# EAGLE design Motherboard (EAGLE 4.16)
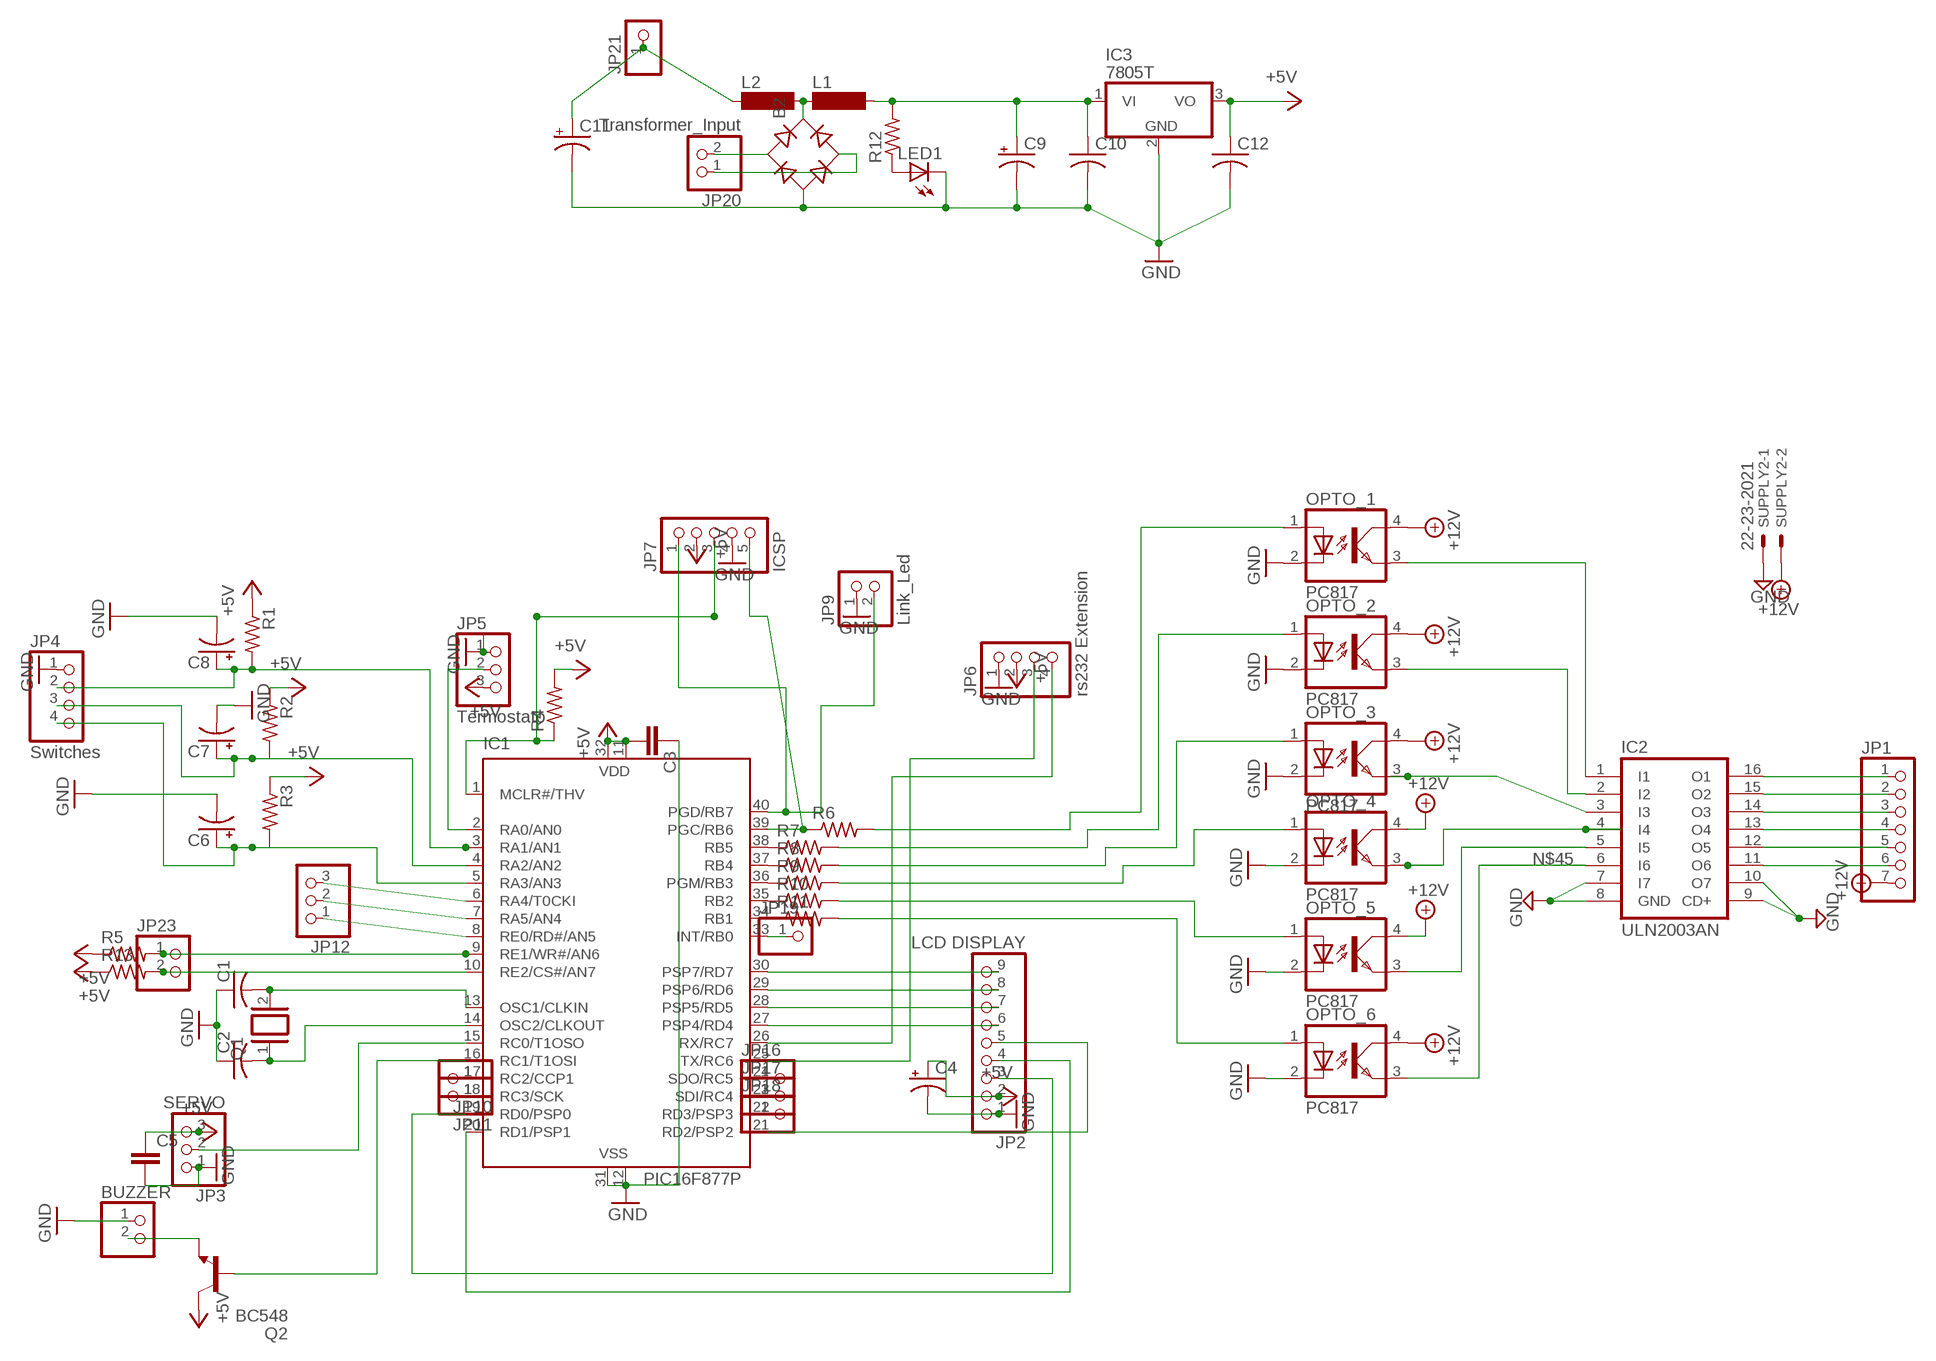
[diagram p0: schematic, sheet 1]

## Parts
B2  RB1A  [RB1A]
BUZZER  PINHD-1X2  [1X02]
C1  C-US050-024X044  [C050-024X044]
C2  C-US050-024X044  [C050-024X044]
C3  C5/2.5  [C5B2.5]
C4  CPOL-USE5-5  [E5-5]
C5  C5/5.5  [C5B5.5]
C6  CPOL-USE2.5-5  [E2,5-5]
C7  CPOL-USE2.5-5  [E2,5-5]
C8  CPOL-USE2.5-5  [E2,5-5]
C9  CPOL-USE5-13  [E5-13]
C10  C-US050-025X075  [C050-025X075]
C11  CPOL-USE5-8.5  [E5-8,5]
C12  C-US050-025X075  [C050-025X075]
IC1  PIC16F877P  [DIL40]
IC2  ULN2003AN  [DIL16]
IC3  7805T  [TO220H]
JP1  PINHD-1X7  [1X07]
JP2  LCD DISPLAY  PINHD-1X9  [1X09]
JP3  SERVO  PINHD-1X3  [1X03]
JP4  Switches  PINHD-1X4  [1X04]
JP5  Termostato  PINHD-1X3  [1X03]
JP6  rs232 Extension  PINHD-1X4  [1X04]
JP7  ICSP  PINHD-1X5  [1X05]
JP9  Link_Led  PINHD-1X2  [1X02]
JP10  PINHD-1X1  [1X01]
JP11  PINHD-1X1  [1X01]
JP12  PINHD-1X3  [1X03]
JP16  PINHD-1X1  [1X01]
JP17  PINHD-1X1  [1X01]
JP18  PINHD-1X1  [1X01]
JP19  PINHD-1X1  [1X01]
JP20  Transformer_Input  PINHD-1X2  [1X02]
JP21  PINHD-1X1  [1X01]
JP23  PINHD-1X2  [1X02]
L1  SD8  [SD8]
L2  SD8  [SD8]
LED1  LED3MM  [LED3MM]
OPTO_1  PC817  [DIL04]
OPTO_2  PC817  [DIL04]
OPTO_3  PC817  [DIL04]
OPTO_4  PC817  [DIL04]
OPTO_5  PC817  [DIL04]
OPTO_6  PC817  [DIL04]
Q1  XTAL  [Q]
Q2  BC548  [TO92-EBC]
R1  R-US_0207/7  [0207/7]
R2  R-US_0207/7  [0207/7]
R3  R-US_0207/7  [0207/7]
R4  R-US_0204/7  [0204/7]
R5  R-US_0204/7  [0204/7]
R6  R-US_0204/7  [0204/7]
R7  R-US_0204/7  [0204/7]
R8  R-US_0204/7  [0204/7]
R9  R-US_0204/7  [0204/7]
R10  R-US_0204/7  [0204/7]
R11  R-US_0204/7  [0204/7]
R12  R-US_0204/7  [0204/7]
R13  R-US_0204/7  [0204/7]
SUPPLY2  22-23-2021  [22-23-2021]

## Nets
+5V: C3.2 C4.+ C5.1 C12.1 IC1.11(VDD) IC1.32(VDD) IC3.3(VO) JP2.2 JP3.3 JP5.3 JP6.2 JP7.2 Q2.C R1.1 R2.1 R3.1 R4.2 R5.1 R13.1
+12V: JP1.7 OPTO_1.4(COL) OPTO_2.4(COL) OPTO_3.4(COL) OPTO_4.4(COL) OPTO_5.4(COL) OPTO_6.4(COL) SUPPLY2.2
GND: B2.- BUZZER.1 C1.1 C2.1 C3.1 C4.- C5.2 C6.- C7.- C8.- C9.- C10.2 C11.- C12.2 IC1.12(VSS) IC1.31(VSS) IC2.7(I7) IC2.8(GND) IC2.9(CD+) IC2.10(O7) IC3.2(GND) JP2.1 JP3.1 JP4.1 JP5.1 JP6.1 JP7.4 JP9.1 LED1.K(C) OPTO_1.2(C) OPTO_2.2(C) OPTO_3.2(C) OPTO_4.2(C) OPTO_5.2(C) OPTO_6.2(C) SUPPLY2.1
N$1: C1.2 IC1.13(OSC1/CLKIN) Q1.2
N$2: C2.2 IC1.14(OSC2/CLKOUT) Q1.1
N$3: C8.+ IC1.3(RA1/AN1) JP4.2 R1.2
N$4: C6.+ IC1.5(RA3/AN3) JP4.4 R3.2
N$5: LED1.A R12.1
N$6: IC1.39(PGC/RB6) JP7.5 R6.1
N$7: IC1.38(RB5) R7.1
N$8: IC1.37(RB4) R8.1
N$9: IC1.36(PGM/RB3) R9.1
N$10: IC1.35(RB2) R10.1
N$11: IC1.34(RB1) R11.1
N$12: IC1.25(TX/RC6) JP6.3
N$13: IC1.26(RX/RC7) JP6.4
N$14: IC1.19(RD0/PSP0) JP2.3
N$15: IC1.20(RD1/PSP1) JP2.4
N$16: IC1.21(RD2/PSP2) JP2.5
N$17: IC1.27(PSP4/RD4) JP2.6
N$18: IC1.28(PSP5/RD5) JP2.7
N$19: IC1.29(PSP6/RD6) JP2.8
N$20: IC1.30(PSP7/RD7) JP2.9
N$21: IC1.1(MCLR#/THV) JP7.3 R4.1
N$22: IC1.2(RA0/AN0) JP5.2
N$23: IC1.33(INT/RB0) JP19.1
N$24: IC1.15(RC0/T1OSO) JP3.2
N$25: IC1.16(RC1/T1OSI) Q2.B
N$26: IC2.12(O5) JP1.5
N$27: IC1.9(RE1/WR#/AN6) JP23.1 R5.2
N$28: IC2.16(O1) JP1.1
N$30: OPTO_2.1(A) R7.2
N$31: OPTO_3.1(A) R8.2
N$32: OPTO_4.1(A) R9.2
N$33: OPTO_5.1(A) R10.2
N$34: OPTO_6.1(A) R11.2
N$35: IC2.15(O2) JP1.2
N$36: IC2.14(O3) JP1.3
N$37: IC2.13(O4) JP1.4
N$38: IC1.8(RE0/RD#/AN5) JP12.1
N$39: IC2.11(O6) JP1.6
N$40: IC2.1(I1) OPTO_1.3(EMIT)
N$41: IC2.2(I2) OPTO_2.3(EMIT)
N$42: IC2.3(I3) OPTO_3.3(EMIT)
N$43: IC2.4(I4) OPTO_4.3(EMIT)
N$44: IC2.5(I5) OPTO_5.3(EMIT)
N$45: IC2.6(I6) OPTO_6.3(EMIT)
N$46: IC1.7(RA5/AN4) JP12.2
N$47: BUZZER.2 Q2.E
N$48: IC1.17(RC2/CCP1) JP10.1
N$49: IC1.18(RC3/SCK) JP11.1
N$50: IC1.6(RA4/T0CKI) JP12.3
N$53: IC1.10(RE2/CS#/AN7) JP23.2 R13.2
N$54: IC1.24(SDO/RC5) JP16.1
N$55: IC1.23(SDI/RC4) JP17.1
N$56: IC1.22(RD3/PSP3) JP18.1
N$57: IC1.40(PGD/RB7) JP7.1 JP9.2
N$58: B2.AC1 JP20.2
N$59: B2.AC2 JP20.1
N$61: C9.+ C10.1 IC3.1(VI) L1.2 R12.2
N$62: B2.+ L1.1 L2.2
N$63: C7.+ IC1.4(RA2/AN2) JP4.3 R2.2
N$64: C11.+ JP21.1 L2.1
N$69: OPTO_1.1(A) R6.2

## Library data of the parts
B2 = rectifier:RB1A: RECTIFIER 1 A
BUZZER JP9 JP20 JP23 = pinhead:PINHD-1X2: PIN HEADER
C1 C2 C10 C12 = rcl:C-US: CAPACITOR, American symbol
C3 C5 = capacitor-wima:C: CAPACITOR naming: grid - package width
C4 C6-C9 C11 = rcl:CPOL-US: POLARIZED CAPACITOR, American symbol
IC1 = microchip:PIC16F87*: MICROCONTROLLER
IC2 = uln-udn:ULN2003A: DRIVER ARRAY
IC3 = linear:78*: Positive VOLTAGE REGULATOR Source: http://cache.national.com/ds/LM/LM78L05.pdf http://www.fairchildsemi.com/ds/LM/LM7805.pdf
JP1 = pinhead:PINHD-1X7: PIN HEADER
JP2 = pinhead:PINHD-1X9: PIN HEADER
JP3 JP5 JP12 = pinhead:PINHD-1X3: PIN HEADER
JP4 JP6 = pinhead:PINHD-1X4: PIN HEADER
JP7 = pinhead:PINHD-1X5: PIN HEADER
JP10 JP11 JP16-JP19 JP21 = pinhead:PINHD-1X1: PIN HEADER
L1 L2 = inductor-neosid:SD8: INDUCTOR nominal inductance
LED1 = led:LED: LED OSRAM: - CHIPLED LG R971, LG N971, LY N971, LG Q971, LY Q971, LO R971, LY R971 LH N974, LH R974 LS Q976, LO Q976, LY Q976 LO Q996 - Hyper CHIPLED LW Q18S LB Q993, LB Q99A, LB R99A - SideLED LS A670, LO A670, LY A670, LG A670, LP A670 LB A673, LV A673, LT A673, LW A673 LH A674 LY A675 LS A676, LA A676, LO A676, LY A676, LW A676 LS A679, LY A679, LG A679 - Hyper Micro SIDELED® LS Y876, LA Y876, LO Y876, LY Y876 LT Y87S - SmartLED LW L88C, LW L88S LB L89C, LB L89S, LG L890 LS L89K, LO L89K, LY L89K LS L896, LA L896, LO L896, LY L896 - TOPLED LS T670, LO T670, LY T670, LG T670, LP T670 LSG T670, LSP T670, LSY T670, LOP T670, LYG T670 LG T671, LOG T671, LSG T671 LB T673, LV T673, LT T673, LW T673 LH T674 LS T676, LA T676, LO T676, LY T676, LB T676, LH T676, LSB T676, LW T676 LB T67C, LV T67C, LT T67C, LS T67K, LO T67K, LY T67K, LW E67C LS E67B, LA E67B, LO E67B, LY E67B, LB E67C, LV E67C, LT E67C LW T67C LS T679, LY T679, LG T679 LS T770, LO T770, LY T770, LG T770, LP T770 LB T773, LV T773, LT T773, LW T773 LH T774 LS E675, LA E675, LY E675, LS T675 LS T776, LA T776, LO T776, LY T776, LB T776 LHGB T686 LT T68C, LB T68C - Hyper Mini TOPLED® LB M676 - Mini TOPLED Santana® LG M470 LS M47K, LO M47K, LY M47K Source: http://www.osram.convergy.de - LUMILED® LXK2-PW12-R00, LXK2-PW12-S00, LXK2-PW14-U00, LXK2-PW14-V00 LXK2-PM12-R00, LXK2-PM12-S00, LXK2-PM14-U00 LXK2-PE12-Q00, LXK2-PE12-R00, LXK2-PE12-S00, LXK2-PE14-T00, LXK2-PE14-U00 LXK2-PB12-K00, LXK2-PB12-L00, LXK2-PB12-M00, LXK2-PB14-N00, LXK2-PB14-P00, LXK2-PB14-Q00 LXK2-PR12-L00, LXK2-PR12-M00, LXK2-PR14-Q00, LXK2-PR14-R00 LXK2-PD12-Q00, LXK2-PD12-R00, LXK2-PD12-S00 LXK2-PH12-R00, LXK2-PH12-S00 LXK2-PL12-P00, LXK2-PL12-Q00, LXK2-PL12-R00 Source: www.luxeon.com
OPTO_1-OPTO_6 = optocoupler:PC817: SHARP OPTO COUPLER
Q1 = special:XTAL: CRYSTAL
Q2 = transistor-npn:BC548*: NPN Transistor
R1-R13 = rcl:R-US_: RESISTOR, American symbol
SUPPLY2 = con-molex:22-23-2021: .100" (2.54mm) Center Header - 2 Pin

## Board
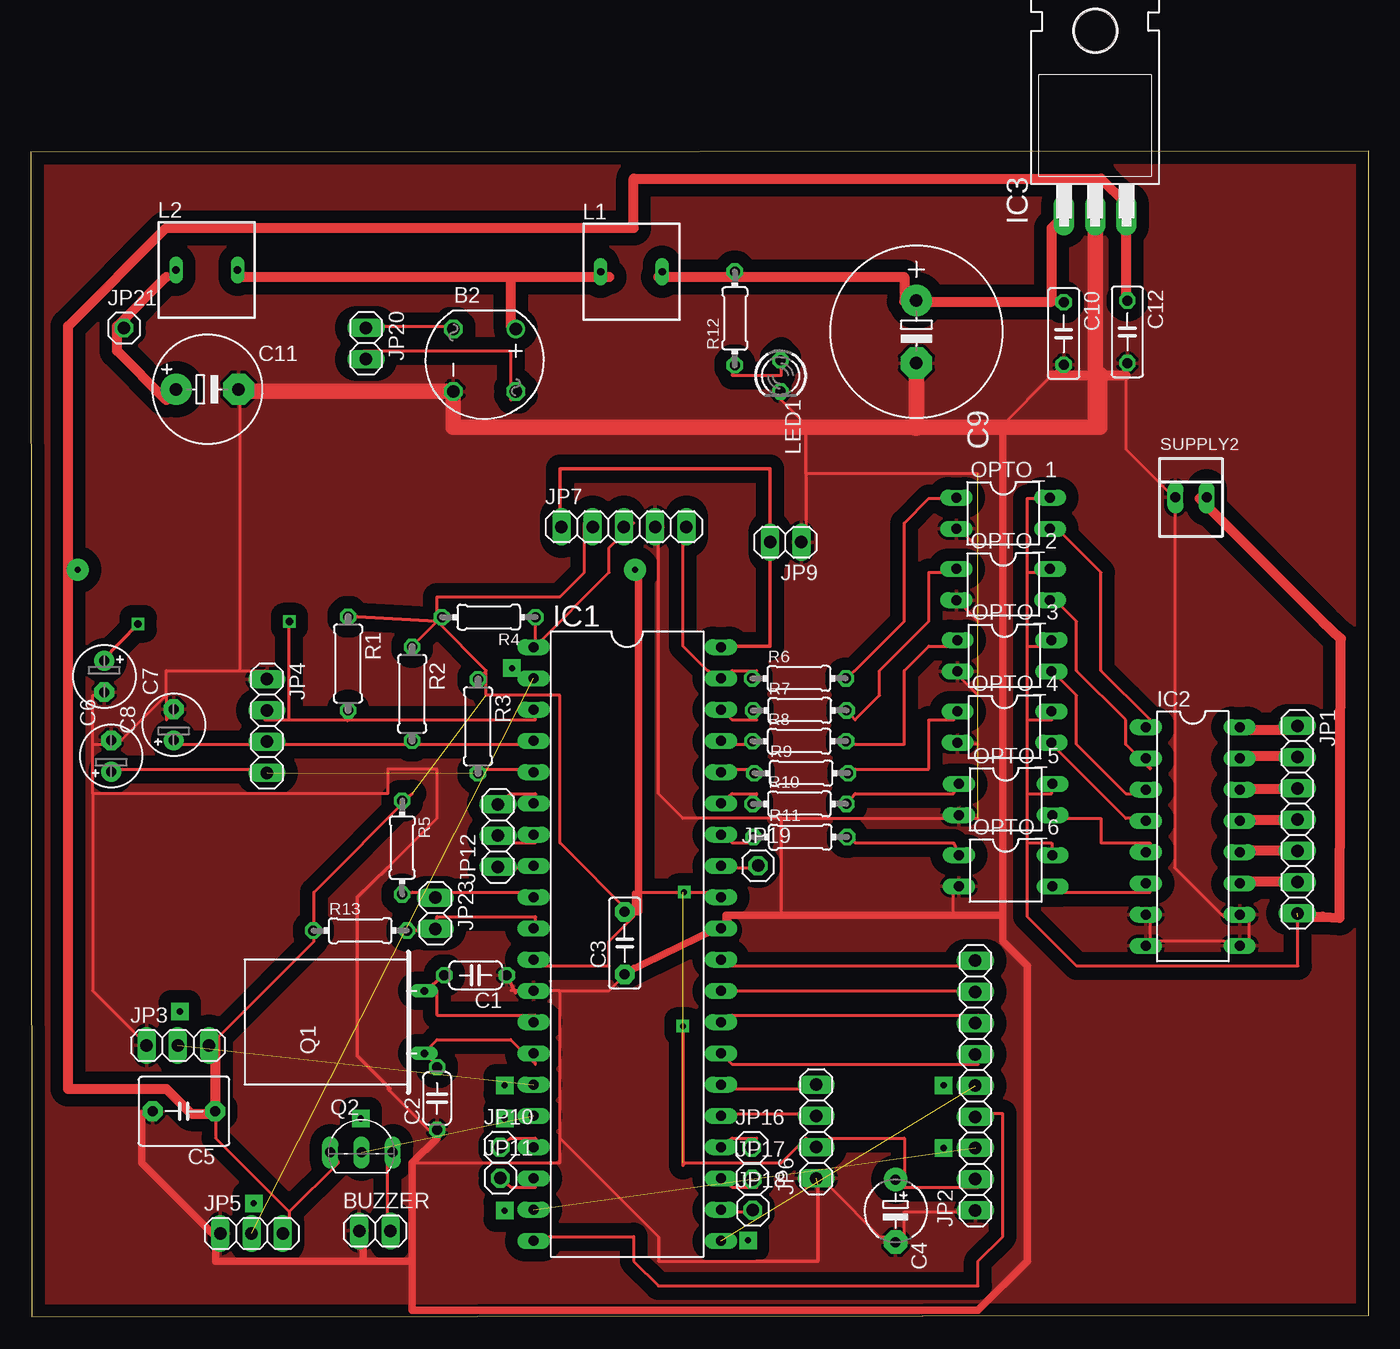
[diagram p1: board, top side]
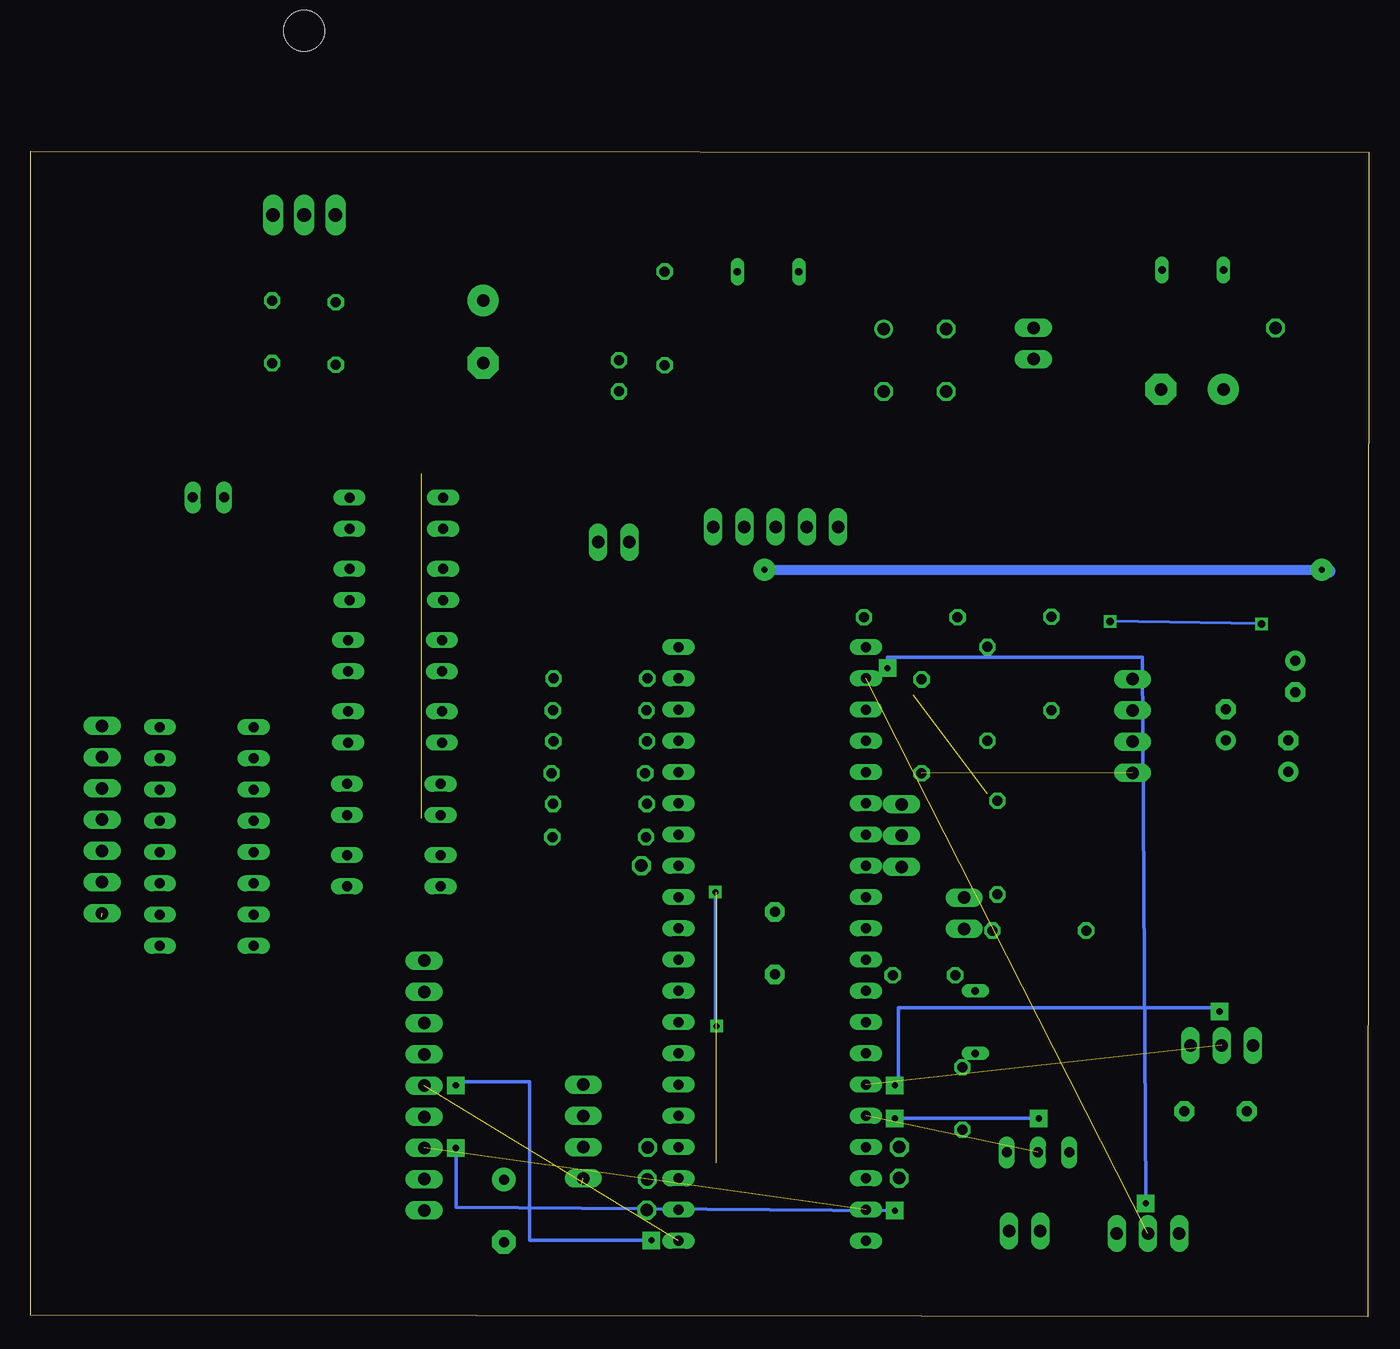
[diagram p2: board, bottom side, seen from below]

Size 108.8 x 94.73 mm. Coordinates in mm from the lower left corner, seen from the top.
Outline: 0.1,0 108.79,0.1 108.8,94.73 0,94.63 0.1,0
Copper layers (1*16): Top 0.035mm / dielectric 1.5mm / Bottom 0.035mm
Design rules "default": minimum track width 10mil, minimum drill 24mil, track to track 8mil, track to pad 8mil, pad to pad 8mil, via to via 8mil, smd to smd 8mil, copper to edge 40mil, drill to drill 8mil, minimum pad ring 10mil, minimum via ring 8mil, stop-mask expansion 4mil, vias tented up to drill 0mil, thermal gap 10mil

### Footprints (pad centres in the part's own frame; a part is rotated, then mirrored left to right if it is on the bottom)
RB1A = drill 1.016 round: + -2.54,2.54 | drill 1.016 octagon: - 2.54,-2.54; AC1 2.54,2.54; AC2 -2.54,-2.54
1X02 = drill 1.016 long: 1 -1.27,0; 2 1.27,0
C050-024X044 = drill 0.813 octagon: 1 -2.54,0; 2 2.54,0
C5B2.5 = drill 0.813 pad 1.6 octagon: 1 -2.54,0; 2 2.54,0
E5-5 = drill 0.813 pad 1.905 round: + -2.54,0 | drill 0.813 pad 1.905 octagon: - 2.54,0
C5B5.5 = drill 0.813 pad 1.6 octagon: 1 -2.54,0; 2 2.54,0
E2,5-5 = drill 0.813 pad 1.6 round: + -1.27,0 | drill 0.813 pad 1.6 octagon: - 1.27,0
E5-13 = drill 1.016 pad 2.54 round: + -2.54,0 | drill 1.016 pad 2.54 octagon: - 2.54,0
C050-025X075 = drill 0.813 octagon: 1 -2.54,0; 2 2.54,0
E5-8,5 = drill 1.016 pad 2.54 round: + -2.54,0 | drill 1.016 pad 2.54 octagon: - 2.54,0
DIL40 = drill 0.813 long: 1 -24.13,-7.62; 2 -21.59,-7.62; 3 -19.05,-7.62; 4 -16.51,-7.62; 5 -13.97,-7.62; 6 -11.43,-7.62; 7 -8.89,-7.62; 8 -6.35,-7.62; 9 -3.81,-7.62; 10 -1.27,-7.62; 11 1.27,-7.62; 12 3.81,-7.62; 13 6.35,-7.62; 14 8.89,-7.62; 15 11.43,-7.62; 16 13.97,-7.62; 17 16.51,-7.62; 18 19.05,-7.62; 19 21.59,-7.62; 20 24.13,-7.62; 21 24.13,7.62; 22 21.59,7.62; 23 19.05,7.62; 24 16.51,7.62; 25 13.97,7.62; 26 11.43,7.62; 27 8.89,7.62; 28 6.35,7.62; 29 3.81,7.62; 30 1.27,7.62; 31 -1.27,7.62; 32 -3.81,7.62; 33 -6.35,7.62; 34 -8.89,7.62; 35 -11.43,7.62; 36 -13.97,7.62; 37 -16.51,7.62; 38 -19.05,7.62; 39 -21.59,7.62; 40 -24.13,7.62
DIL16 = drill 0.813 long: 1 -8.89,-3.81; 2 -6.35,-3.81; 3 -3.81,-3.81; 4 -1.27,-3.81; 5 1.27,-3.81; 6 3.81,-3.81; 7 6.35,-3.81; 8 8.89,-3.81; 9 8.89,3.81; 10 6.35,3.81; 11 3.81,3.81; 12 1.27,3.81; 13 -1.27,3.81; 14 -3.81,3.81; 15 -6.35,3.81; 16 -8.89,3.81
TO220H = drill 1.118 long: 1 -2.54,-10.16; 2 0,-10.16; 3 2.54,-10.16 | hole 3.302: 0,4.826
1X07 = drill 1.016 long: 1 -7.62,0; 2 -5.08,0; 3 -2.54,0; 4 0,0; 5 2.54,0; 6 5.08,0; 7 7.62,0
1X09 = drill 1.016 long: 1 -10.16,0; 2 -7.62,0; 3 -5.08,0; 4 -2.54,0; 5 0,0; 6 2.54,0; 7 5.08,0; 8 7.62,0; 9 10.16,0
1X03 = drill 1.016 long: 1 -2.54,0; 2 0,0; 3 2.54,0
1X04 = drill 1.016 long: 1 -3.81,0; 2 -1.27,0; 3 1.27,0; 4 3.81,0
1X05 = drill 1.016 long: 1 -5.08,0; 2 -2.54,0; 3 0,0; 4 2.54,0; 5 5.08,0
1X01 = drill 1.016 octagon: 1 0,0
SD8 = drill 0.6 long: 1 -2.5,0; 2 2.5,0
LED3MM = drill 0.813 octagon: A -1.27,0; K 1.27,0
DIL04 = drill 0.813 long: 1 -1.27,-3.81; 2 1.27,-3.81; 3 1.27,3.81; 4 -1.27,3.81
Q = drill 0.61 long: 1 -2.54,-7.62; 2 2.54,-7.62
TO92-EBC = drill 0.813 long: B 0,-1.27; C -2.54,-1.27; E 2.54,-1.27
0207/7 = drill 0.813 octagon: 1 -3.81,0; 2 3.81,0
0204/7 = drill 0.813 octagon: 1 -3.81,0; 2 3.81,0
22-23-2021 = drill 0.813 long: 1 -1.27,0; 2 1.27,0

### Placement (x,y rotation side)
B2  36.9,77.73 270 top
BUZZER  27.99,6.96 0 top
C1  36.17,27.74 180 top
C2  33.04,17.73 90 top
C3  48.3,30.35 90 top
C4  70.33,8.59 270 top
C5  12.46,16.69 180 top
C6  6.54,45.56 90 top
C7  11.63,48.1 90 top
C8  5.98,52.03 270 top
C9  72.01,80.04 270 top
C10  83.99,79.9 270 top
C11  14.36,75.37 0 top
C12  89.17,80.04 270 top
IC1  48.5,30.28 270 top
IC2  94.49,39.03 270 top
IC3  86.56,99.69 0 top
JP1  102.99,40.4 270 top
JP2  76.81,18.78 90 top
JP3  11.96,22.04 0 top
JP4  19.21,48 270 top
JP5  17.96,6.76 0 top
JP6  63.87,15.04 90 top
JP7  48.23,64.19 0 top
JP9  61.39,62.94 180 top
JP10  38.17,13.77 0 top
JP11  38.18,11.25 0 top
JP12  38,39.09 90 top
JP16  58.62,13.75 0 top
JP17  58.66,11.15 0 top
JP18  58.7,8.65 0 top
JP19  59.14,36.65 0 top
JP20  27.27,79.1 270 top
JP21  7.58,80.35 0 top
JP23  32.9,32.78 270 top
L1  48.85,84.93 0 top
L2  14.31,85.07 0 top
LED1  60.96,76.47 270 top
OPTO_1  79.08,65.29 270 top
OPTO_2  79.08,59.5 270 top
OPTO_3  79.18,53.71 270 top
OPTO_4  79.18,47.92 270 top
OPTO_5  79.28,42.03 270 top
OPTO_6  79.28,36.24 270 top
Q1  24.37,23.93 90 top
Q2  26.89,14.61 0 top
R1  25.8,53.08 270 top
R2  31.01,50.62 270 top
R3  36.36,47.98 270 top
R4  37.24,56.85 180 top
R5  30.2,38.12 270 top
R6  62.47,51.87 0 top
R7  62.53,49.27 0 top
R8  62.49,46.77 0 top
R9  62.65,44.17 0 top
R10  62.51,41.67 0 top
R11  62.57,38.97 0 top
R12  57.25,81.13 90 top
R13  26.79,31.37 0 top
SUPPLY2  94.35,66.58 0 top

### Tracks (layer width: path | path; a pad name or v marks a point on that pad's centre or on a via)
+5V  (via drill 0.5 pad 1.02)  (2 unrouted)
  Top 0.254: 71.03,10.5 77.03,10.5 JP2.2 | 71.03,10.5 71.03,14.5 65.03,14.5 JP6.2 63.03,14.5 61.03,12.5 53.03,12.5 | 71.03,10.5 C4.+ | 49.03,32.5 47.03,30.5 47.03,28.5 41.03,28.5 IC1.11 | 49.03,32.5 49.03,34.5 53.03,34.5 v53.13,34.5 55.03,34.5 IC1.32 | 21.03,8.5 25.03,12.5 Q2.C | 21.03,8.5 21.03,6.5 JP5.3 | 23.03,30.5 15.03,22.5 JP3.3 | 23.03,30.5 23.03,34.5 31.03,42.5 R5.1 | 23.03,30.5 R13.1 | 21.03,8.5 15.03,14.5 15.03,16.5 C5.1 | 89.03,82.5 C12.1 | 89.03,88.5 IC3.3 89.03,90.5 | 33.03,56.5 31.03,54.5 R2.1 | 37.03,52.5 33.03,56.5 | 33.03,56.5 33.03,58.5 43.03,58.5 45.03,60.5 45.03,64.5 JP7.2 | 33.03,56.5 R4.2 | 49.03,32.5 43.03,38.5 43.03,50.5 37.03,50.5 37.03,52.5 | 49.03,32.5 C3.2 | 37.03,52.5 R3.1
  Top 0.305: 53.03,23.4 53.03,12.3 53.13,12.4 | 33.03,56.5 26.53,56.9 25.93,56.9 R1.1
  Top 0.813: 15.03,22.5 15.03,16.5 13.03,16.5 11.03,18.5 3.03,18.5 3.03,80.5 11.03,88.5 49.03,88.5 49.03,92.5 87.03,92.5 89.03,90.5 | 89.03,88.5 89.03,82.5
  Bottom 0.305: 53.13,34.4 53.13,23.5 v53.03,23.6
+12V  (1 unrouted)
  Top 0.254: 81.03,38.5 83.03,38.5 OPTO_6.4 | 81.03,38.5 81.03,42.5 | 81.03,42.5 83.03,42.5 OPTO_5.4 | 81.03,48.5 83.03,48.5 OPTO_4.4 | 81.03,42.5 81.03,48.5 | 81.03,54.5 83.03,54.5 OPTO_3.4 | 81.03,48.5 81.03,54.5 | 81.03,60.5 83.03,60.5 OPTO_2.4 | 81.03,54.5 81.03,60.5 | 81.03,60.5 81.03,66.5 83.03,66.5 OPTO_1.4 | 95.03,66.5 SUPPLY2.2 | 81.03,38.5 81.03,32.5 85.03,28.5 103.03,28.5 103.03,32.5
  Top 0.813: 95.03,66.5 105.03,56.5 106.53,55.1 106.43,32.4 105.03,32.5 103.03,32.5
GND  (6 unrouted)
  Top 0.254: 63.03,68.5 63.03,62.5 JP9.1 | 63.03,68.5 63.03,72.5 61.03,74.5 LED1.K | 77.03,46.5 75.03,46.5 OPTO_4.2 | 77.03,50.5 75.03,52.5 OPTO_3.2 | 75.03,40.5 77.03,40.5 | 77.03,56.5 75.03,58.5 OPTO_2.2 | 77.03,62.5 75.03,64.5 OPTO_1.2 | 77.03,68.5 63.03,68.5 | 61.03,32.5 75.03,32.5 75.03,34.5 OPTO_6.2 | 61.03,32.5 57.03,32.5 56.69,32.15 IC1.31 | 61.03,40.5 53.03,40.5 51.03,42.5 51.03,64.5 JP7.4 | 61.03,32.5 61.03,40.5 | 61.03,40.5 75.03,40.5 | 75.03,40.5 OPTO_5.2 | 91.03,30.5 91.03,32.5 IC2.7 | 91.03,30.5 97.03,30.5 IC2.9 99.03,30.5 99.03,32.5 IC2.10 97.03,32.5 93.03,36.5 93.03,66.5 | 91.03,30.5 IC2.8 | 93.03,66.5 89.03,70.5 89.03,76.5 C12.2 | 93.03,66.5 SUPPLY2.1 | 79.03,72.5 83.03,76.5 C10.2 | 5.03,46.5 5.03,50.5 C8.- | 5.03,42.5 5.03,46.5 | 5.03,42.5 5.03,26.5 9.03,22.5 JP3.1 | 5.03,46.5 7.03,46.5 | 17.03,52.5 11.03,52.5 11.03,50.5 | 17.03,52.5 19.03,52.5 JP4.1 | 11.03,50.5 11.03,48.5 C7.- | 17.03,52.5 17.03,74.5 | 7.03,46.5 11.03,50.5 | 7.03,46.5 C6.- | 71.03,6.5 69.03,6.5 65.03,10.5 JP6.1 63.03,10.5 | 71.03,6.5 71.03,8.5 77.03,8.5 JP2.1 | 71.03,6.5 C4.- | 41.03,26.5 39.43,26.5 39.03,26.5 | 43.03,26.5 41.03,26.5 | 43.03,26.5 47.03,26.5 49.03,28.5 C3.1 | 41.03,26.5 IC1.12 | C2.1 33.03,14.5 29.13,18.4 29.03,18.5 | 27.03,6.5 BUZZER.1 | 43.03,14.5 43.03,12.5 31.03,12.5 | 43.03,14.5 43.03,26.5 | 15.03,6.5 JP5.1 | 59.03,4.5 51.03,4.5 51.03,6.5 43.03,14.5 | 5.03,42.5 29.03,42.5 29.03,44.5 33.03,44.5 33.03,40.5 29.03,36.5
  Top 0.305: 59.03,4.5 64.03,4.5 64.03,10.7 | 29.03,36.5 26.53,34.1 26.53,21.2 29.23,18.5 29.13,18.4 | 39.43,26.5 39.43,26.3 C1.1
  Top 0.61: C5.2 9.03,16.5 9.03,12.5 15.03,6.5 15.03,4.5 27.03,4.5 | 33.03,14.5 31.03,12.5 31.03,4.5 | 27.03,4.5 31.03,4.5 | 27.03,4.5 27.03,6.5 | 31.03,4.5 31.03,0.5 77.03,0.5 81.03,4.5 81.03,28.5 79.03,30.5 79.03,32.6 | 79.03,32.6 79.03,72.5 | 56.69,32.15 56.53,32.15 56.53,32.6 79.03,32.6
  Top 0.813: 83.03,76.5 86.63,76.5 89.03,76.5
  Top 1.27: B2.- 34.43,75.1 | B2.- 16.9,75.2 C11.- | B2.- 34.36,72.3 71.93,72.3 | 86.63,72.3 86.93,72.3 86.93,76.6 86.63,76.6 86.63,76.5 | 86.63,72.3 71.93,72.3 | 71.93,72.3 71.93,72.2 72.01,72.2 C9.- | 86.63,72.3 86.63,72.5 86.56,72.5 IC3.2
  pour Top (isolate 1.016): 1.03,93.8 108.13,93.8 108.13,-1.9 1.03,-1.9
N$1
  Top 0.254: IC1.13 41.03,24.5 33.03,24.5 33.03,26.5 Q1.2
  Top 0.305: Q1.2 32.23,26.6 C1.2
N$2
  Top 0.254: C2.2 33.03,20.5 Q1.1 33.03,22.5 39.03,22.5 41.03,20.5 IC1.14
N$3  (via drill 0.6)
  Top 0.254: 21.03,48.5 19.03,48.5 JP4.2 | 21.03,48.5 25.73,48.5 | 25.73,48.5 41.03,48.5 IC1.3 | 21.03,48.5 v21.03,56.5 | 25.73,48.5 25.73,48.4 R1.2
  Top 0.305: C8.+ 5.83,53.3 v8.73,56.3
  Bottom 0.254: v21.03,56.5 21.23,56.5 v8.73,56.3
N$4  (1 unrouted)
  Top 0.254: R3.2 37.03,44.5 41.03,44.5 IC1.5 | JP4.4 19.03,44.5 7.03,44.5 C6.+
N$5
  Top 0.254: R12.1 57.03,76.5 61.03,76.5 61.03,78.5 LED1.A
N$6
  Top 0.254: R6.1 59.03,52.5 57.03,52.5 IC1.39 55.03,52.5 53.03,54.5 53.03,64.5 JP7.5
N$7
  Top 0.254: IC1.38 57.03,48.5 59.03,48.5 R7.1
N$8
  Top 0.254: IC1.37 57.03,46.5 59.03,46.5 R8.1
N$9
  Top 0.254: IC1.36 57.03,44.5 59.03,44.5 R9.1
N$10
  Top 0.254: IC1.35 57.03,42.5 59.03,42.5 R10.1
N$11
  Top 0.254: IC1.34 57.03,38.5 59.03,38.5 R11.1
N$12
  Top 0.254: IC1.25 57.03,16.5 63.03,16.5 JP6.3
N$13
  Top 0.254: IC1.26 57.03,18.5 63.03,18.5 JP6.4
N$14  (1 unrouted)
N$15
  Top 0.254: IC1.20 41.03,6.5 49.03,6.5 49.03,4.5 51.03,2.5 77.03,2.5 77.03,4.5 79.03,6.5 79.03,16.5 77.03,16.5 JP2.4
N$16  (1 unrouted)
N$17
  Top 0.254: IC1.27 57.03,20.5 77.03,20.5 JP2.6
N$18
  Top 0.254: IC1.28 57.03,24.5 77.03,24.5 JP2.7
N$19
  Top 0.254: IC1.29 57.03,26.5 77.03,26.5 JP2.8
N$20
  Top 0.254: IC1.30 57.03,28.5 77.03,28.5 JP2.9
N$21
  Top 0.254: 41.03,54.5 41.03,56.5 R4.1 | 41.03,54.5 47.03,60.5 47.03,62.5 49.03,64.5 JP7.3 | IC1.1 41.03,54.5
N$22  (1 unrouted)
N$23
  Top 0.254: IC1.33 57.03,36.5 59.03,36.5 JP19.1
N$24  (1 unrouted)
N$25  (1 unrouted)
N$26
  Top 0.813: 102.99,37.9 103.03,37.9 | 102.99,37.9 JP1.5 | IC2.12 98.3,37.9 102.99,37.9
N$27
  Top 0.254: 33.03,34.5 41.03,34.5 IC1.9 | 33.03,34.5 31.03,34.5 R5.2 | 33.03,34.5 JP23.1
N$28
  Top 0.813: JP1.1 102.99,47.7 98.3,47.7 IC2.16
N$30
  Top 0.254: R7.2 67.03,48.5 69.03,50.5 69.03,52.5 73.03,56.5 73.03,60.5 75.03,60.5 OPTO_2.1
N$31
  Top 0.254: R8.2 67.03,46.5 71.03,46.5 71.03,52.5 73.03,54.5 75.03,54.5 OPTO_3.1
N$32
  Top 0.254: R9.2 67.03,44.5 73.03,44.5 73.03,48.5 75.03,48.5 OPTO_4.1
N$33
  Top 0.254: R10.2 67.03,42.5 75.03,42.5 OPTO_5.1
N$34
  Top 0.254: OPTO_6.1 75.03,38.5 67.03,38.5 R11.2
N$35
  Top 0.813: JP1.2 102.99,45.6 98.3,45.6 IC2.15
N$36
  Top 0.813: JP1.3 102.99,42.9 98.3,42.9 IC2.14
N$37
  Top 0.813: IC2.13 98.3,40.4 JP1.4
N$38
  Top 0.254: IC1.8 41.03,36.5 39.03,36.5 JP12.1
N$39
  Top 0.813: 102.99,35.4 103.03,35.4 | 102.99,35.4 JP1.6 | IC2.11 98.3,35.4 102.99,35.4
N$40
  Top 0.254: IC2.1 91.03,48.5 87.03,52.5 87.03,60.5 83.03,64.5 OPTO_1.3
N$41
  Top 0.254: IC2.2 91.03,44.5 89.03,46.5 89.03,48.5 85.03,52.5 85.03,56.5 83.03,58.5 OPTO_2.3
N$42
  Top 0.254: IC2.3 91.03,42.5 89.03,42.5 85.03,46.5 85.03,50.5 83.03,52.5 OPTO_3.3
N$43
  Top 0.254: IC2.4 91.03,40.5 89.03,40.5 83.03,46.5 OPTO_4.3
N$44
  Top 0.254: OPTO_5.3 83.03,40.5 87.03,40.5 87.03,38.5 91.03,38.5 IC2.5
N$45
  Top 0.254: OPTO_6.3 83.03,34.5 91.03,34.5 IC2.6
N$46
  Top 0.254: IC1.7 41.03,38.5 39.03,38.5 JP12.2
N$47
  Top 0.254: Q2.E 29.03,12.5 29.03,6.5 BUZZER.2
N$48
  Top 0.254: IC1.17 41.03,14.5 39.03,14.5 JP10.1
N$49
  Top 0.254: IC1.18 41.03,10.5 39.03,10.5 JP11.1
N$50
  Top 0.254: IC1.6 41.03,42.5 39.03,42.5 JP12.3
N$53
  Top 0.254: IC1.10 41.03,32.5 33.03,32.5 JP23.2
  Top 0.305: 33.03,32.5 32.83,31.4 31.03,31.4 R13.2
N$54
  Top 0.254: IC1.24 57.03,14.5 59.03,14.5 JP16.1
N$55
  Top 0.254: IC1.23 57.03,10.5 59.03,10.5 JP17.1
N$56
  Top 0.254: IC1.22 57.03,8.5 59.03,8.5 JP18.1
N$57
  Top 0.254: IC1.40 57.03,54.5
  Top 0.305: JP7.1 43.03,64.19 43.03,68.9 60.13,68.9 60.13,63.2 | 56.23,54.41 56.23,54.2 | 56.23,54.41 IC1.40 | 57.13,54.5 57.03,54.5 56.23,54.5 | 56.23,54.5 56.23,54.41 | 55.93,54.5 56.23,54.5 | 56.23,54.5 57.13,54.5 | 57.13,54.5 58.63,54.5 60.13,54.5 60.13,63.2 | 60.13,63.2 JP9.2
N$58
  Top 0.254: JP20.2 27.03,78.5 39.03,78.5 39.03,74.5 B2.AC1
N$59
  Top 0.254: JP20.1 27.03,80.5 35.03,80.5 B2.AC2
N$61
  Top 0.254: L1.2 51.03,84.5 | 57.03,84.5 R12.2 | 71.03,82.5 C9.+ 73.03,82.5 | 83.03,82.5 C10.1
  Top 0.813: IC3.1 83.03,88.5 83.03,82.5 73.03,82.5 | 51.03,84.5 57.03,84.5 71.03,84.5 71.03,82.5
N$62
  Top 0.254: L2.2 17.03,84.5 | 39.03,80.5 B2.+ | 47.03,84.5 L1.1
  Top 0.813: 17.03,84.5 39.03,84.5 | 39.03,84.5 39.03,80.5 | 39.03,84.5 47.03,84.5
N$63
  Top 0.254: 19.03,46.5 11.03,46.5 C7.+ | 31.03,46.5 41.03,46.5 IC1.4 | 19.03,46.5 31.03,46.5 | 19.03,46.5 JP4.3 | 31.03,46.5 R2.2
N$64
  Top 0.254: 11.03,84.5 L2.1 | 11.03,74.5 C11.+ | 7.03,80.5 JP21.1
  Top 0.813: 11.03,84.5 7.03,80.5 7.03,78.5 11.03,74.5
N$69
  Top 0.254: R6.2 67.03,52.5 71.03,56.5 71.03,64.5 73.03,66.5 75.03,66.5 OPTO_1.1
S$1  (via drill 0.5 pad 1.78)
  Bottom 0.813: 49.03,60.6 49.03,60.7 v3.83,60.7 3.23,60.7 | 3.23,60.7 3.13,60.7 3.13,60.5 3.23,60.5 3.23,60.7
  other vias: 49.13,60.7
S$2
  Top 0.61: 49.43,60.2 49.43,32.9 48.03,32.9 48.03,33 48.23,33
S$3
  Top 0.61: 48.43,28 55.63,31.5 56.33,31.4 56.53,31.4
S$4  (via drill 0.5 pad 1.42)
  other vias: 38.53,18.8
S$5  (via drill 0.5 pad 1.42)
  other vias: 38.53,16.1
S$6  (via drill 0.5 pad 1.42)
  other vias: 26.83,16.1
S$7  (via drill 0.5 pad 1.42)
  other vias: 12.13,24.8
S$8
  Bottom 0.305: 38.23,16.1 27.43,16.1 27.13,16.1
S$9
  Bottom 0.305: 38.23,18.8 38.23,25.1 12.73,25.1 12.43,25.1
S$10  (via drill 0.5 pad 1.42)
  other vias: 39.13,52.7
S$11  (via drill 0.5 pad 1.42)
  other vias: 18.13,9.2
S$12
  Bottom 0.305: 18.13,9.5 18.43,53.6 39.13,53.6 39.13,53.3 39.43,53.3
S$13  (via drill 0.5 pad 1.42)
  Bottom 0.305: v38.53,8.6 74.23,8.9 v74.23,13.7 73.93,13.4
S$15  (via drill 0.5 pad 1.42)
  other vias: 58.33,6.2
S$16  (via drill 0.5 pad 1.42)
  other vias: 74.23,18.8
S$17
  Bottom 0.305: 58.63,6.2 68.23,6.2 68.23,19.1 73.93,19.1